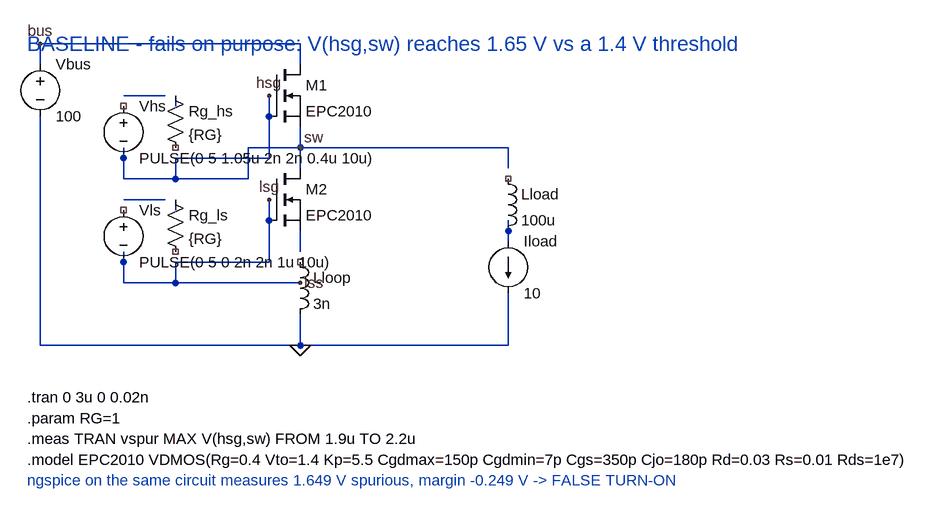
[diagram p0: schematic 1_baseline_FALSE_TURN_ON.asc]
1_baseline_FALSE_TURN_ON.asc, the LTspice schematic file:
Version 4
SHEET 1 1600 1000
WIRE 320 96 720 96
WIRE 720 96 720 128
WIRE 320 96 320 128
WIRE 720 224 720 256
WIRE 720 256 720 288
WIRE 720 256 1040 256
WIRE 720 384 720 416
WIRE 720 512 720 560
WIRE 320 560 720 560
WIRE 1040 560 720 560
WIRE 320 208 320 560
WIRE 1040 256 1040 288
WIRE 1040 368 1040 400
WIRE 1040 480 1040 560
WIRE 448 176 512 176
WIRE 528 272 528 304
WIRE 448 256 448 304
WIRE 448 304 528 304
WIRE 528 304 640 304
WIRE 640 304 640 256
WIRE 640 256 720 256
WIRE 528 176 528 192
WIRE 528 272 672 272
WIRE 672 272 672 176
WIRE 448 336 512 336
WIRE 528 432 528 464
WIRE 448 416 448 464
WIRE 448 464 528 464
WIRE 528 464 720 464
WIRE 528 336 528 352
WIRE 528 432 672 432
WIRE 672 432 672 336
FLAG 720 256 sw
FLAG 720 560 0
FLAG 320 96 bus
FLAG 672 176 hsg
FLAG 672 336 lsg
FLAG 720 464 lss
SYMBOL nmos 672 128 R0
SYMATTR InstName M1
SYMATTR Value EPC2010
SYMBOL nmos 672 288 R0
SYMATTR InstName M2
SYMATTR Value EPC2010
SYMBOL voltage 320 112 R0
SYMATTR InstName Vbus
SYMATTR Value 100
SYMBOL ind 704 416 R0
SYMATTR InstName Lloop
SYMATTR Value 3n
SYMBOL ind 1024 288 R0
SYMATTR InstName Lload
SYMATTR Value 100u
SYMBOL current 1040 400 R0
SYMATTR InstName Iload
SYMATTR Value 10
SYMBOL res 512 160 R0
SYMATTR InstName Rg_hs
SYMATTR Value {RG}
SYMBOL res 512 320 R0
SYMATTR InstName Rg_ls
SYMATTR Value {RG}
SYMBOL voltage 448 176 R0
SYMATTR InstName Vhs
SYMATTR Value PULSE(0 5 1.05u 2n 2n 0.4u 10u)
SYMBOL voltage 448 336 R0
SYMATTR InstName Vls
SYMATTR Value PULSE(0 5 0 2n 2n 1u 10u)
TEXT 300 736 Left 2 !.model EPC2010 VDMOS(Rg=0.4 Vto=1.4 Kp=5.5 Cgdmax=150p Cgdmin=7p Cgs=350p Cjo=180p Rd=0.03 Rs=0.01 Rds=1e7)
TEXT 300 640 Left 2 !.tran 0 3u 0 0.02n
TEXT 300 672 Left 2 !.param RG=1
TEXT 300 704 Left 2 !.meas TRAN vspur MAX V(hsg,sw) FROM 1.9u TO 2.2u
TEXT 300 96 Left 3 ;BASELINE - fails on purpose: V(hsg,sw) reaches 1.65 V vs a 1.4 V threshold
TEXT 300 768 Left 2 ;ngspice on the same circuit measures 1.649 V spurious, margin -0.249 V -> FALSE TURN-ON

The netlist it stands for:
* 1_baseline_FALSE_TURN_ON.asc
M1 bus hsg hsg hsg EPC2010
M2 hsg lss N001 N001 EPC2010
Vbus bus 0 100
Lloop NC_01 0 3n
Lload NC_02 N002 100u
Iload N002 0 10
Rg_hs N004 NC_03 {RG}
Rg_ls N006 NC_04 {RG}
Vhs NC_05 hsg PULSE(0 5 1.05u 2n 2n 0.4u 10u)
Vls NC_06 lss PULSE(0 5 0 2n 2n 1u 10u)
.model NMOS NMOS
.model PMOS PMOS
.lib standard.mos
.model EPC2010 VDMOS(Rg=0.4 Vto=1.4 Kp=5.5 Cgdmax=150p Cgdmin=7p Cgs=350p Cjo=180p Rd=0.03 Rs=0.01 Rds=1e7)
.tran 0 3u 0 0.02n
.param RG=1
.meas TRAN vspur MAX V(hsg,sw) FROM 1.9u TO 2.2u
* BASELINE - fails on purpose: V(hsg,sw) reaches 1.65 V vs a 1.4 V threshold
* ngspice on the same circuit measures 1.649 V spurious, margin -0.249 V -> FALSE TURN-ON
.backanno
.end